# Altium schematic sheet MCU.SchDoc
size A4; SheetNumber: 6; SheetTotal: 8
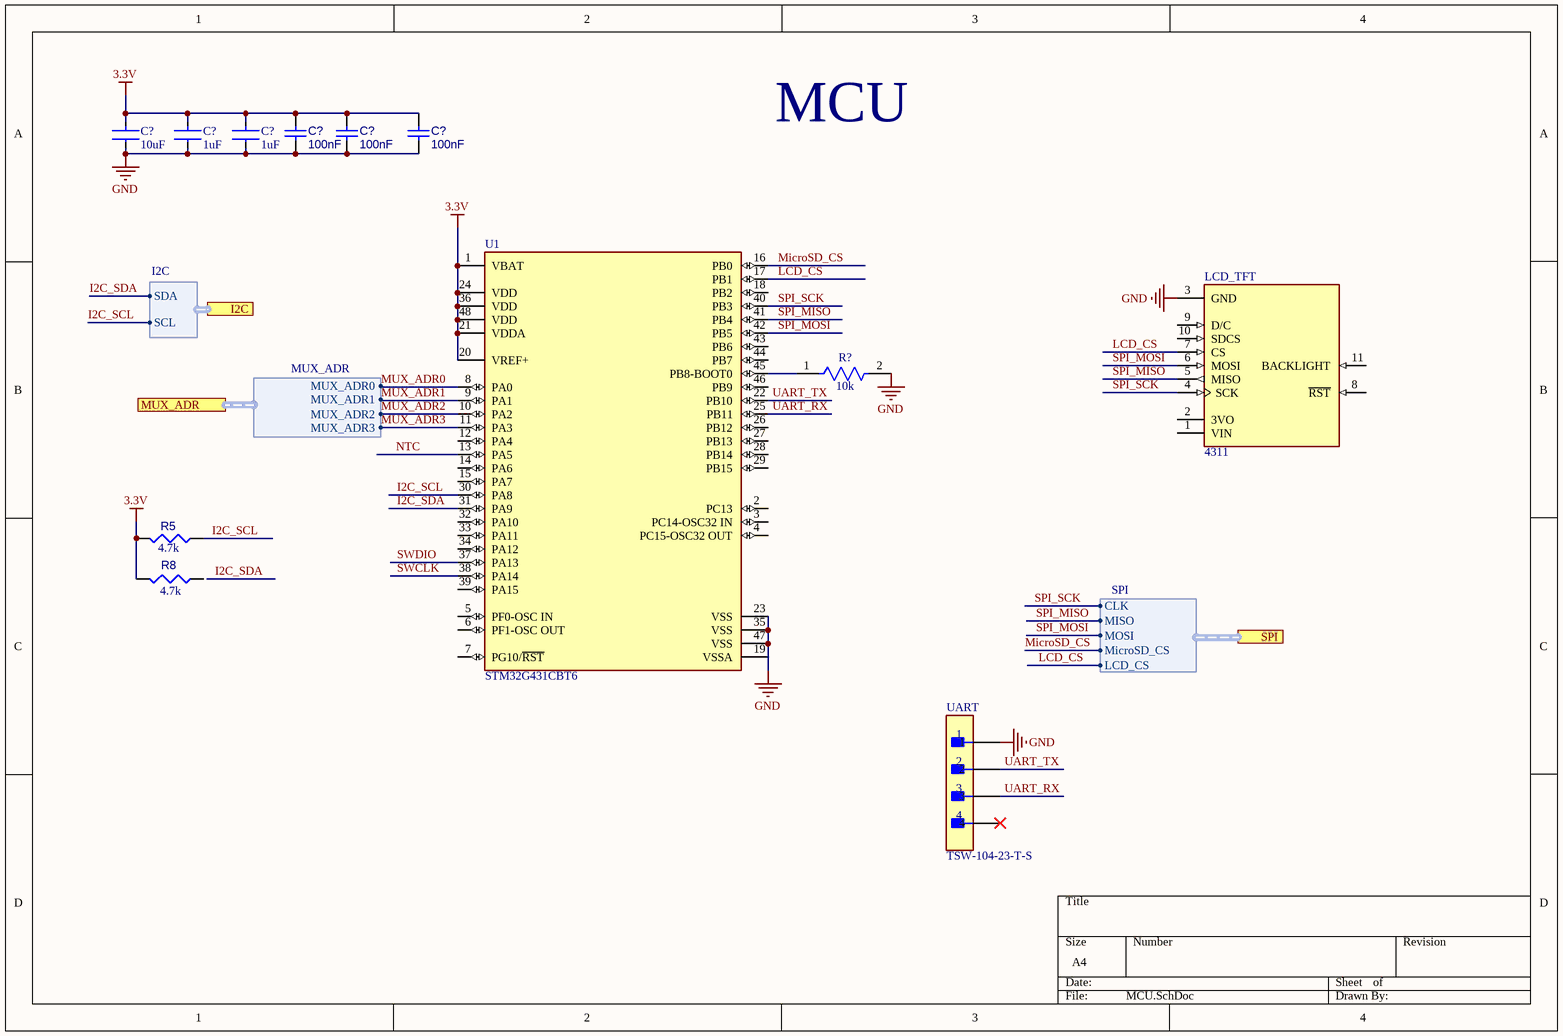
[diagram p0: MCU.SchDoc]

## Parts
(Parts that share a designator on the sheet are numbered #1, #2 ... from top to bottom, then left to right.)
C?#1  10uF  [FP-GCM32E-0_3-IPC_B]
C?#2  1uF  [FP-1206-L_3_2_0_15-W_1_6-IPC_C]
C?#3  1uF  [FP-1206-L_3_2_0_15-W_1_6-IPC_C]
C?#4  100nF  [CAPC2013X95X50LL10T25]
C?#5  100nF  [CAPC2013X95X50LL10T25]
C?#6  100nF  [CAPC2013X95X50LL10T25]
LCD_TFT  4311  [MODULE_4311]
R5  value 4.7k  [RESC2013X70X40ML20T20]  (hidden comment: Resistor 4k7 +/-1% 0805 125 mW)
R8  value 4.7k  [RESC2013X70X40ML20T20]  (hidden comment: Resistor 4k7 +/-1% 0805 125 mW)
R?  10k  [FP-AC0603-IPC_A]
U1  STM32G431CBT6  [FP-LQFP48-5B-MFG]
UART  TSW-104-23-T-S  [FP-TSW-104-23-T-S-MFG]

## Ports
I2C (harness I2C), MUX_ADR (harness MUX_ADR), SPI (harness SPI)

## Harnesses
MUX_ADR: MUX_ADR0, MUX_ADR1, MUX_ADR2, MUX_ADR3
I2C: SDA, SCL
SPI: MISO, MOSI, CLK, MicroSD_CS, LCD_CS

## Nets
3.3V: C?#1.2 C?#2.1 C?#3.1 C?#4.2 C?#5.2 C?#6.2 R5.2 R8.2 U1.1(VBAT) U1.20(VREF+) U1.21(VDDA) U1.24(VDD) U1.36(VDD) U1.48(VDD)
GND: C?#1.1 C?#2.2 C?#3.2 C?#4.1 C?#5.1 C?#6.1 LCD_TFT.3(GND) R?.2 U1.19(VSSA) U1.23(VSS) U1.35(VSS) U1.47(VSS) UART.1
I2C_SCL: R5.1 U1.30(PA8) ; port I2C.SCL
I2C_SDA: U1.31(PA9) ; port I2C.SDA
LCD_CS: LCD_TFT.7(CS) U1.17(PB1) ; port SPI.LCD_CS
MicroSD_CS: U1.16(PB0) ; port SPI.MicroSD_CS
MUX_ADR0: U1.8(PA0) ; port MUX_ADR.MUX_ADR0
MUX_ADR1: U1.9(PA1) ; port MUX_ADR.MUX_ADR1
MUX_ADR2: U1.10(PA2) ; port MUX_ADR.MUX_ADR2
MUX_ADR3: U1.11(PA3) ; port MUX_ADR.MUX_ADR3
NTC: U1.13(PA5)
SPI_MISO: LCD_TFT.5(MISO) U1.41(PB4) ; port SPI.MISO
SPI_MOSI: LCD_TFT.6(MOSI) U1.42(PB5) ; port SPI.MOSI
SPI_SCK: LCD_TFT.4(SCK) U1.40(PB3)
SWCLK: U1.38(PA14)
SWDIO: U1.37(PA13)
UART_RX: U1.25(PB11) UART.3
UART_TX: U1.22(PB10) UART.2
NetR?_1: R?.1 U1.45(PB8-BOOT0)

Not connected (* = marked no-connect by the designer): LCD_TFT 1(VIN) 2(3VO) 8(~{RST}) 9(D/C) 10(SDCS) 11(BACKLIGHT); R8 1; U1 2(PC13) 3(PC14-OSC32_IN) 4(PC15-OSC32_OUT) 5(PF0-OSC_IN) 6(PF1-OSC_OUT) 7(PG10/~{RST}) 12(PA4) 14(PA6) 15(PA7) 18(PB2) 26(PB12) 27(PB13) 28(PB14) 29(PB15) 32(PA10) 33(PA11) 34(PA12) 39(PA15) 43(PB6) 44(PB7) 46(PB9); UART 4*

## Notes on the sheet
- MCU

## Library data of the parts
C?#1 = CMP-2000-06321-2: Ceramic Capacitor for Automotive 10uF ±10% 25VDC X7R 1210 Embossed T/R; Voltage: 25V; Thickness: 0.106inch; Min Operating Temperature: -55°C; Max Operating Temperature: 125°C; Ratings: AEC-Q200; Packaging: Tape and Reel; Package Quantity: 1; Width: 2.5mm; Mount: Surface Mount; Height: 2.5mm; Case Code (Imperial): 1210; Length: 3.2mm; Capacitance: 10uF; Tolerance: 10%; Lead Free: Lead Free; Dielectric: X7R; REACH SVHC: No SVHC; Case/Package: 1210; Voltage Rating: 25V; Depth: 2.5mm; Case Code (Metric): 3225; Termination: SMD/SMT; Voltage Rating (DC): 25V; Radiation Hardening: No
C?#2 C?#3 = CMP-14477-000720-2: None; Dielectric: X5R; Voltage Rating (DC): 50V; Tolerance: 10%; Mount: Surface Mount; Min Operating Temperature: -55°C; Width: 1.6mm; Package Quantity: 1; Case Code (Imperial): 1206; Case Code (Metric): 3216; Termination: SMD/SMT; Packaging: Tape and Reel; Height: 0.85mm; Voltage Rating: 50V; Thickness: 0.037inch; Capacitance: 1uF; Series: M; Number of Pins: 2; Max Operating Temperature: 85°C; Length: 0.126inch; RoHS Compliant: Yes; Case/Package: 1206; Halogen Free: Halogen Free
C?#4-C?#6 = CMP-001-00018-6: Capacitor 100 nF +/-10% 50 V 0805; Voltage Rating: 50V; Tolerance: 10%; Capacitor Type: Ceramic; Value: 100nF; Pins: 2; Max Operating Temperature: 125°C; Min Operating Temperature: -55°C; Mounting Technology: SM; Case/Package: 0805; RoHS Compliant: True
LCD_TFT = CMP-007-00036-1: Graphic LCD Display Module Red, Green, Blue (RGB) TFT - Color, IPS (In-Plane Switching) SPI 2 (50.80mm) 320 x 240; MF: Adafruit Industries LLC; Check_prices: https://www.snapeda.com/parts/4311/Adafruit+Industries/view-part/?ref=eda; Value: *; Case/Package: None; Design Item ID: 4311; Component Type: Standard; MP: 4311; SnapEDA_Link: https://www.snapeda.com/parts/4311/Adafruit+Industries/view-part/?ref=snap; Pins: 11; Source: 4311.SchLib
R5 R8 = CMP-009-00032-5: Chip Resistor, 4.7 KOhm, +/- 1%, 0.125 W, -55 to 155 degC, 0805 (2012 Metric); Power: 125mW; Voltage Rating: 150V; Mounting Technology: SM; RoHS Compliant: True; Tolerance: 1%; Min Operating Temperature: -55°C; Max Operating Temperature: 155°C; Case/Package: 0805; Pins: 2
R? = CMP-03412-040683-1: RES 10kΩ 5.00% 0.2W 0603
U1 = CMP-12105-000030-1: MAINSTREAM ARM CORTEX-M4+ MCU 17; Manufacturer: STMicroelectronics; Number Of Adc Channels: 17; Number Of I/Os: 38; Standoff Height: 0.05mm; Number Of Usb Channels: 1; Data Bus Width: 32bits; Number Of I2C Channels: 3; Number Of Pwm Channels: 31; Frequency: 170MHz; Memory Type: FLASH; Number Of Timers/Counters: 14; Ram Size: 32KBytes; Max Junction Temp: +105°C; Memory Size: 128KBytes; Min Supply Voltage: 1.62V; Max Supply Voltage: 3.6V; Number Of Uart Channels: 4; Interface: I2C,SPI,UART,USART,CAN,USB,LIN,IrDA,I2S; Temperature Range Low: -40°C; Lead Free: Yes; Device Class L3: Microcontrollers; Number Of Cores: 1; Temperature Range High: +85°C; Height: 1.6mm; Digikey Description: MAINSTREAM ARM CORTEX-M4+ MCU 17; Device Class L1: Integrated Circuits (ICs); Package: LQFP48-5B; RoHS: TRUE; Number Of A/D Converters: 1; Core Architecture: Arm Cortex-M4; Device Class L2: Embedded Processors and Controllers; ComponentLink2Description: Datasheet; Temperature: -40°C to +85°C; Ambient Temperature Range High: +85°C; Ambient Temperature Range Low: -40°C; Octopart: https://octopart.com/stm32g431cbt6-stmicroelectronics-98835224; ComponentLink2URL: https://www.st.com/resource/en/datasheet/stm32g431cb.pdf; Automotive: No; Number Of Spi Channels: 3; Manufacturer Part Number: STM32G431CBT6; Category: IC
UART = CMP-02766-001388-1: CONN HEADER VERT 4POS 2.54MM; Number of Contacts: 4; Gender: Male; Connector Type: Male Pin; Max Voltage Rating (AC): 550V; Max Current Rating: 7.6A; Radiation Hardening: No; Lead Free: Lead Free; RoHS Compliant: Yes; Contact Material: Bronze; Number of Positions: 4; Housing Color: Black; Min Operating Temperature: -55°C; Mount: Through Hole; Number of Rows: 1; Orientation: Straight; Contact Mating Length: 0.23inch; Contact Type: Male Pin; REACH SVHC: No SVHC; Max Operating Temperature: 105°C; Color: Black; Pitch: 2.54mm; Length: 10.16mm; Series: TSW; Packaging: Bulk; Contact Plating: Tin; Package Quantity: 1; Termination: Solder; Housing Material: Polyester; Width: 2.54mm; Depth: 2.54mm